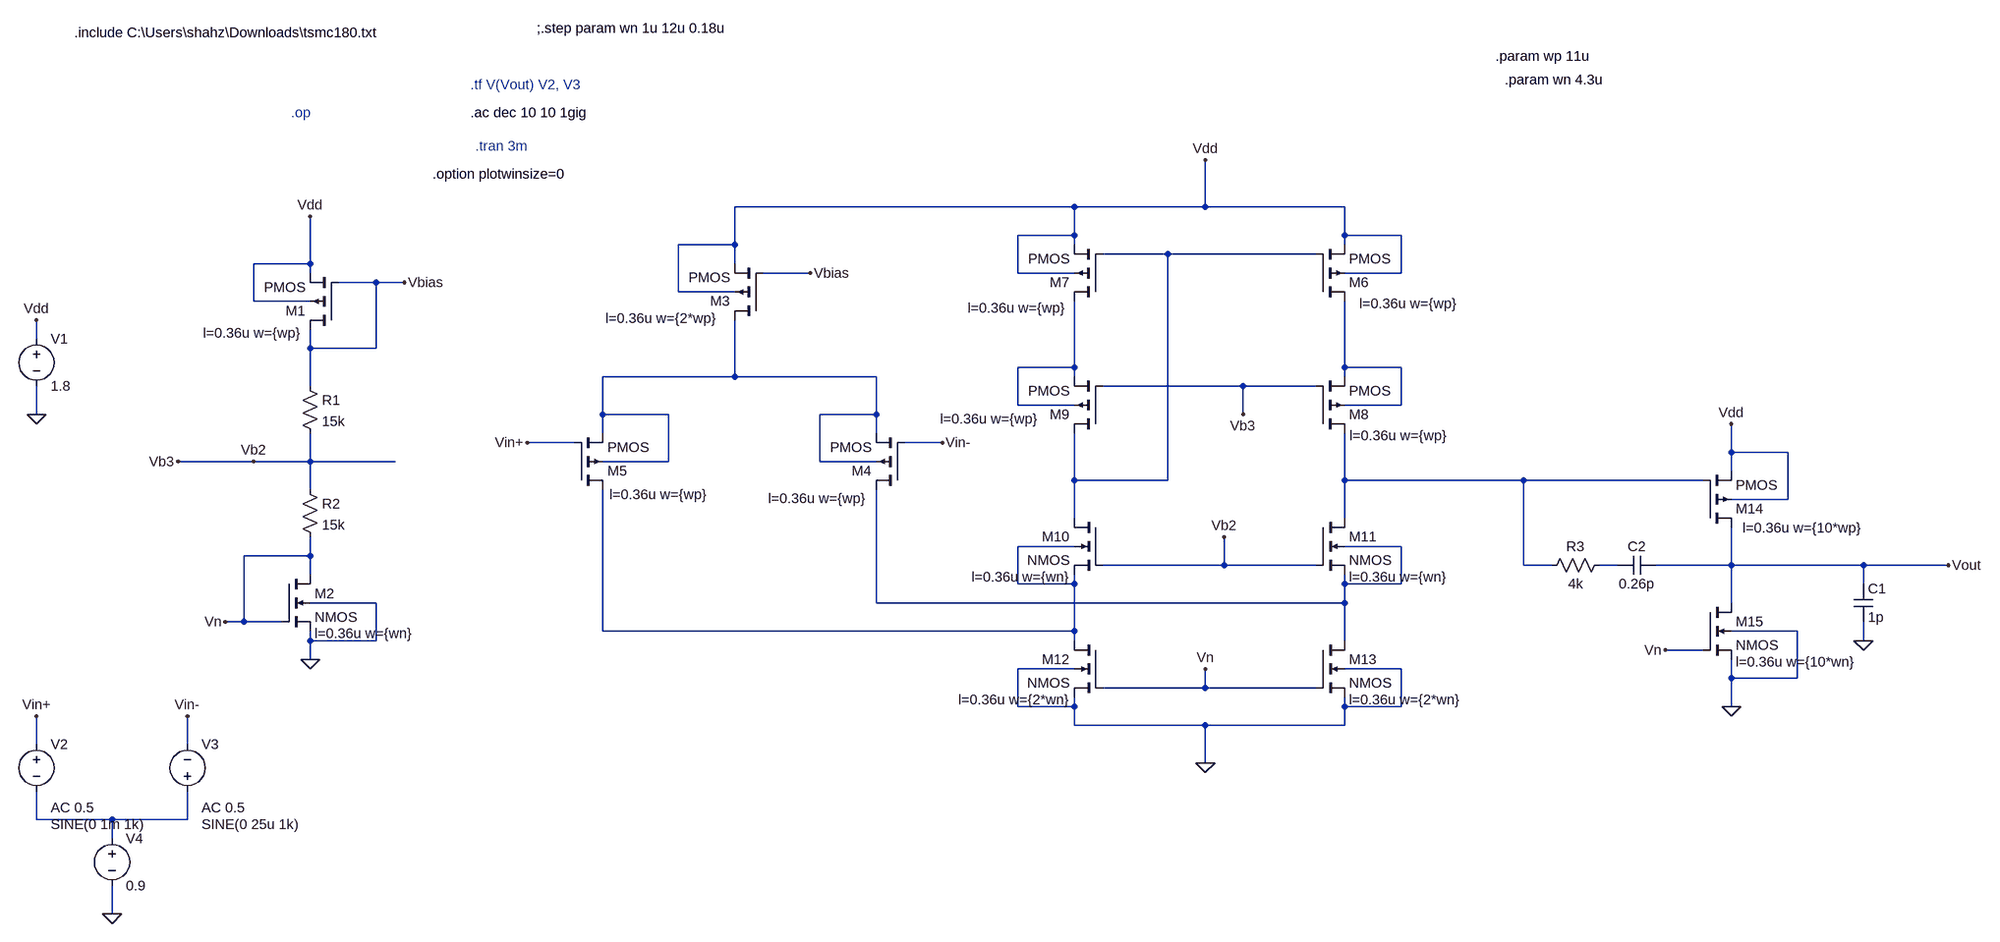
[diagram p0: schematic Folded_Cascode_Two_Stage.asc]
Folded_Cascode_Two_Stage.asc, the LTspice schematic file:
Version 4
SHEET 1 1956 904
WIRE 208 -320 -368 -320
WIRE 480 -320 480 -400
WIRE 480 -320 208 -320
WIRE 736 -320 480 -320
WIRE 208 -272 208 -320
WIRE 208 -272 112 -272
WIRE 736 -272 736 -320
WIRE 832 -272 736 -272
WIRE -368 -256 -368 -320
WIRE -368 -256 -464 -256
WIRE 208 -256 208 -272
WIRE 736 -256 736 -272
WIRE 416 -240 256 -240
WIRE 688 -240 416 -240
WIRE -1088 -224 -1088 -304
WIRE -1088 -224 -1184 -224
WIRE -368 -224 -368 -256
WIRE -1088 -208 -1088 -224
WIRE -240 -208 -320 -208
WIRE 112 -208 112 -272
WIRE 208 -208 112 -208
WIRE 832 -208 832 -272
WIRE 832 -208 736 -208
WIRE -976 -192 -1040 -192
WIRE -928 -192 -976 -192
WIRE -464 -176 -464 -256
WIRE -368 -176 -464 -176
WIRE -1184 -160 -1184 -224
WIRE -1088 -160 -1184 -160
WIRE -1552 -96 -1552 -128
WIRE -1088 -80 -1088 -112
WIRE -976 -80 -976 -192
WIRE -976 -80 -1088 -80
WIRE 208 -48 208 -160
WIRE 208 -48 112 -48
WIRE 736 -48 736 -160
WIRE 832 -48 736 -48
WIRE -368 -32 -368 -128
WIRE -368 -32 -592 -32
WIRE -128 -32 -368 -32
WIRE 208 -32 208 -48
WIRE 736 -32 736 -48
WIRE -1088 -16 -1088 -80
WIRE 544 -16 256 -16
WIRE 688 -16 544 -16
WIRE 112 16 112 -48
WIRE 208 16 112 16
WIRE 832 16 832 -48
WIRE 832 16 736 16
WIRE -1552 32 -1552 -16
WIRE -592 32 -592 -32
WIRE -480 32 -592 32
WIRE -128 32 -128 -32
WIRE -128 32 -224 32
WIRE 544 32 544 -16
WIRE -592 64 -592 32
WIRE -128 64 -128 32
WIRE -640 80 -720 80
WIRE -16 80 -80 80
WIRE 1392 96 1392 48
WIRE 1488 96 1392 96
WIRE -1184 112 -1312 112
WIRE -1088 112 -1088 64
WIRE -1088 112 -1184 112
WIRE -944 112 -1088 112
WIRE -480 112 -480 32
WIRE -480 112 -592 112
WIRE -224 112 -224 32
WIRE -128 112 -224 112
WIRE 1392 128 1392 96
WIRE 208 144 208 64
WIRE 416 144 416 -240
WIRE 416 144 208 144
WIRE 736 144 736 64
WIRE 1040 144 736 144
WIRE 1344 144 1040 144
WIRE -1088 160 -1088 112
WIRE 1488 176 1488 96
WIRE 1488 176 1392 176
WIRE 208 208 208 144
WIRE 736 208 736 144
WIRE 208 256 112 256
WIRE 832 256 736 256
WIRE -1088 272 -1088 240
WIRE -1088 272 -1200 272
WIRE 512 288 512 240
WIRE 512 288 256 288
WIRE 688 288 512 288
WIRE 1040 288 1040 144
WIRE 1088 288 1040 288
WIRE 1200 288 1168 288
WIRE 1392 288 1392 224
WIRE 1392 288 1264 288
WIRE 1616 288 1392 288
WIRE 1872 288 1616 288
WIRE -1088 304 -1088 272
WIRE 112 320 112 256
WIRE 208 320 208 304
WIRE 208 320 112 320
WIRE 736 320 736 304
WIRE 832 320 832 256
WIRE 832 320 736 320
WIRE 1616 320 1616 288
WIRE -976 352 -1088 352
WIRE -128 352 -128 160
WIRE 736 352 736 320
WIRE 736 352 -128 352
WIRE 1392 352 1392 288
WIRE -1200 384 -1200 272
WIRE -1200 384 -1232 384
WIRE -1136 384 -1200 384
WIRE -592 400 -592 160
WIRE 208 400 208 320
WIRE 208 400 -592 400
WIRE 1504 400 1392 400
WIRE -1088 416 -1088 400
WIRE -976 416 -976 352
WIRE -976 416 -1088 416
WIRE 208 416 208 400
WIRE 736 416 736 352
WIRE 1616 416 1616 384
WIRE 1344 432 1280 432
WIRE -1088 448 -1088 416
WIRE 208 464 112 464
WIRE 832 464 736 464
WIRE 1392 480 1392 448
WIRE 1504 480 1504 400
WIRE 1504 480 1392 480
WIRE 480 496 480 464
WIRE 480 496 256 496
WIRE 688 496 480 496
WIRE 112 528 112 464
WIRE 208 528 208 512
WIRE 208 528 112 528
WIRE 736 528 736 512
WIRE 832 528 832 464
WIRE 832 528 736 528
WIRE 1392 528 1392 480
WIRE 208 560 208 528
WIRE 480 560 208 560
WIRE 736 560 736 528
WIRE 736 560 480 560
WIRE -1552 592 -1552 544
WIRE -1296 592 -1296 544
WIRE 480 624 480 560
WIRE -1552 720 -1552 672
WIRE -1424 720 -1552 720
WIRE -1296 720 -1296 672
WIRE -1296 720 -1424 720
WIRE -1424 752 -1424 720
WIRE -1424 880 -1424 832
FLAG -1088 -304 Vdd
FLAG -1552 -128 Vdd
FLAG -1552 32 0
FLAG -928 -192 Vbias
FLAG -1312 112 Vb3
FLAG -1088 448 0
FLAG -1232 384 Vn
FLAG -1184 112 Vb2
FLAG 480 624 0
FLAG 480 -400 Vdd
FLAG -240 -208 Vbias
FLAG 544 32 Vb3
FLAG 512 240 Vb2
FLAG -1424 880 0
FLAG -1552 544 Vin+
FLAG -1296 544 Vin-
FLAG -720 80 Vin+
FLAG -16 80 Vin-
FLAG 1872 288 Vout
FLAG 480 464 Vn
FLAG 1616 416 0
FLAG 1392 528 0
FLAG 1392 48 Vdd
FLAG 1280 432 Vn
DATAFLAG 880 144 ""
DATAFLAG -256 -32 ""
DATAFLAG 368 352 ""
DATAFLAG 288 144 ""
DATAFLAG 480 -16 ""
DATAFLAG 416 288 ""
DATAFLAG -944 112 ""
DATAFLAG 1792 288 ""
SYMBOL pmos4 -1040 -112 R180
WINDOW 123 64 -6 Left 2
SYMATTR Value2 l=0.36u w={wp}
SYMATTR InstName M1
SYMBOL voltage -1552 -112 R0
WINDOW 123 0 0 Left 0
WINDOW 39 0 0 Left 0
SYMATTR InstName V1
SYMATTR Value 1.8
SYMBOL res -1104 -32 R0
SYMATTR InstName R1
SYMATTR Value 15k
SYMBOL nmos4 -1136 304 R0
WINDOW 123 56 100 Left 2
SYMATTR Value2 l=0.36u w={wn}
SYMATTR InstName M2
SYMBOL pmos4 -320 -128 R180
WINDOW 123 79 3 Left 2
SYMATTR Value2 l=0.36u w={2*wp}
SYMATTR InstName M3
SYMBOL pmos4 -80 160 R180
WINDOW 123 65 -15 Left 2
SYMATTR Value2 l=0.36u w={wp}
SYMATTR InstName M4
SYMBOL pmos4 -640 160 M180
WINDOW 123 60 -8 Left 2
SYMATTR Value2 l=0.36u w={wp}
SYMATTR InstName M5
SYMBOL pmos4 688 -160 M180
WINDOW 123 73 -4 Left 2
SYMATTR Value2 l=0.36u w={wp}
SYMATTR InstName M6
SYMBOL pmos4 256 -160 R180
WINDOW 123 63 -11 Left 2
SYMATTR Value2 l=0.36u w={wp}
SYMATTR InstName M7
SYMBOL pmos4 688 64 M180
WINDOW 123 57 -4 Left 2
SYMATTR Value2 l=0.36u w={wp}
SYMATTR InstName M8
SYMBOL pmos4 256 64 R180
WINDOW 123 110 24 Left 2
SYMATTR Value2 l=0.36u w={wp}
SYMATTR InstName M9
SYMBOL nmos4 256 208 M0
WINDOW 123 56 100 Left 2
SYMATTR Value2 l=0.36u w={wn}
SYMATTR InstName M10
SYMBOL nmos4 688 208 R0
WINDOW 123 56 100 Left 2
SYMATTR Value2 l=0.36u w={wn}
SYMATTR InstName M11
SYMBOL nmos4 256 416 M0
WINDOW 123 56 100 Left 2
SYMATTR Value2 l=0.36u w={2*wn}
SYMATTR InstName M12
SYMBOL nmos4 688 416 R0
WINDOW 123 56 100 Left 2
SYMATTR Value2 l=0.36u w={2*wn}
SYMATTR InstName M13
SYMBOL voltage -1552 576 R0
WINDOW 3 24 152 Left 2
WINDOW 123 24 124 Left 2
WINDOW 39 0 0 Left 0
SYMATTR Value SINE(0 1m 1k)
SYMATTR Value2 AC 0.5
SYMATTR InstName V2
SYMBOL voltage -1296 688 M180
WINDOW 0 24 96 Left 2
WINDOW 3 24 -40 Left 2
WINDOW 123 24 -12 Left 2
WINDOW 39 0 0 Left 0
SYMATTR InstName V3
SYMATTR Value SINE(0 25u 1k)
SYMATTR Value2 AC 0.5
SYMBOL voltage -1424 736 R0
WINDOW 123 0 0 Left 0
WINDOW 39 0 0 Left 0
SYMATTR InstName V4
SYMATTR Value 0.9
SYMBOL cap 1600 320 R0
SYMATTR InstName C1
SYMATTR Value 1p
SYMBOL res -1104 144 R0
SYMATTR InstName R2
SYMATTR Value 15k
SYMBOL pmos4 1344 224 M180
WINDOW 123 67 -1 Left 2
SYMATTR Value2 l=0.36u w={10*wp}
SYMATTR InstName M14
SYMBOL nmos4 1344 352 R0
WINDOW 123 56 100 Left 2
SYMATTR Value2 l=0.36u w={10*wn}
SYMATTR InstName M15
SYMBOL cap 1264 272 R90
WINDOW 0 0 32 VBottom 2
WINDOW 3 32 32 VTop 2
SYMATTR InstName C2
SYMATTR Value 0.26p
SYMBOL res 1184 272 R90
WINDOW 0 0 56 VBottom 2
WINDOW 3 32 56 VTop 2
SYMATTR InstName R3
SYMATTR Value 4k
TEXT -1488 -616 Left 2 !.include C:\\Users\\shahz\\Downloads\\tsmc180.txt
TEXT -1120 -480 Left 2 ;.op
TEXT 992 -576 Left 2 !.param wp 11u
TEXT -704 -624 Left 2 !;.step param wn 1u 12u 0.18u
TEXT 1008 -536 Left 2 !.param wn 4.3u
TEXT -816 -480 Left 2 !.ac dec 10 10 1gig
TEXT -816 -528 Left 2 ;.tf V(Vout) V2, V3
TEXT -808 -424 Left 2 ;.tran 3m
TEXT -880 -376 Left 2 !.option plotwinsize=0

The netlist it stands for:
* Folded_Cascode_Two_Stage.asc
M1 Vbias Vbias Vdd Vdd PMOS l=0.36u w={wp}
V1 Vdd 0 1.8
R1 Vbias Vb2 15k
M2 Vn Vn 0 0 NMOS l=0.36u w={wn}
M3 N004 Vbias Vdd Vdd PMOS l=0.36u w={2*wp}
M4 N007 Vin- N004 N004 PMOS l=0.36u w={wp}
M5 N006 Vin+ N004 N004 PMOS l=0.36u w={wp}
M6 N003 N001 Vdd Vdd PMOS l=0.36u w={wp}
M7 N002 N001 Vdd Vdd PMOS l=0.36u w={wp}
M8 N005 Vb2 N003 N003 PMOS l=0.36u w={wp}
M9 N001 Vb2 N002 N002 PMOS l=0.36u w={wp}
M10 N001 Vb2 N006 N006 NMOS l=0.36u w={wn}
M11 N005 Vb2 N007 N007 NMOS l=0.36u w={wn}
M12 N006 Vn 0 0 NMOS l=0.36u w={2*wn}
M13 N007 Vn 0 0 NMOS l=0.36u w={2*wn}
V2 Vin+ N009 SINE(0 1m 1k) AC 0.5
V3 N009 Vin- SINE(0 25u 1k) AC 0.5
V4 N009 0 0.9
C1 Vout 0 1p
R2 Vb2 Vn 15k
M14 Vout N005 Vdd Vdd PMOS l=0.36u w={10*wp}
M15 Vout Vn 0 0 NMOS l=0.36u w={10*wn}
C2 Vout N008 0.26p
R3 N008 N005 4k
.model NMOS NMOS
.model PMOS PMOS
.lib standard.mos
.include C:\Users\shahz\Downloads\tsmc180.txt
* .op
.param wp 11u
;.step param wn 1u 12u 0.18u
.param wn 4.3u
.ac dec 10 10 1gig
* .tf V(Vout) V2, V3
* .tran 3m
.option plotwinsize=0
.backanno
.end